# Altium schematic sheet S3_Connectors.SchDoc: Connectors
size Tabloid; DrawnBy: Dhrumil Parikh; SheetNumber: 3; SheetTotal: 6; PageSetup: Record=PageOptions|CenterHorizontal=True|CenterVertical=True|PrintScale=0.62|XCorrection=1.00|YCorrection=1.00|PrintKind=1|BorderSize=5000000|LeftOffset=0|BottomOffset=0|Orientation=2|PaperLength=1000|PaperWidth=1000|Scale=100|PaperSource=7|PrintQuality=600|MediaType=1|DitherType=10|PaperKind=Letter|PrintScaleMode=1; PageSize: T
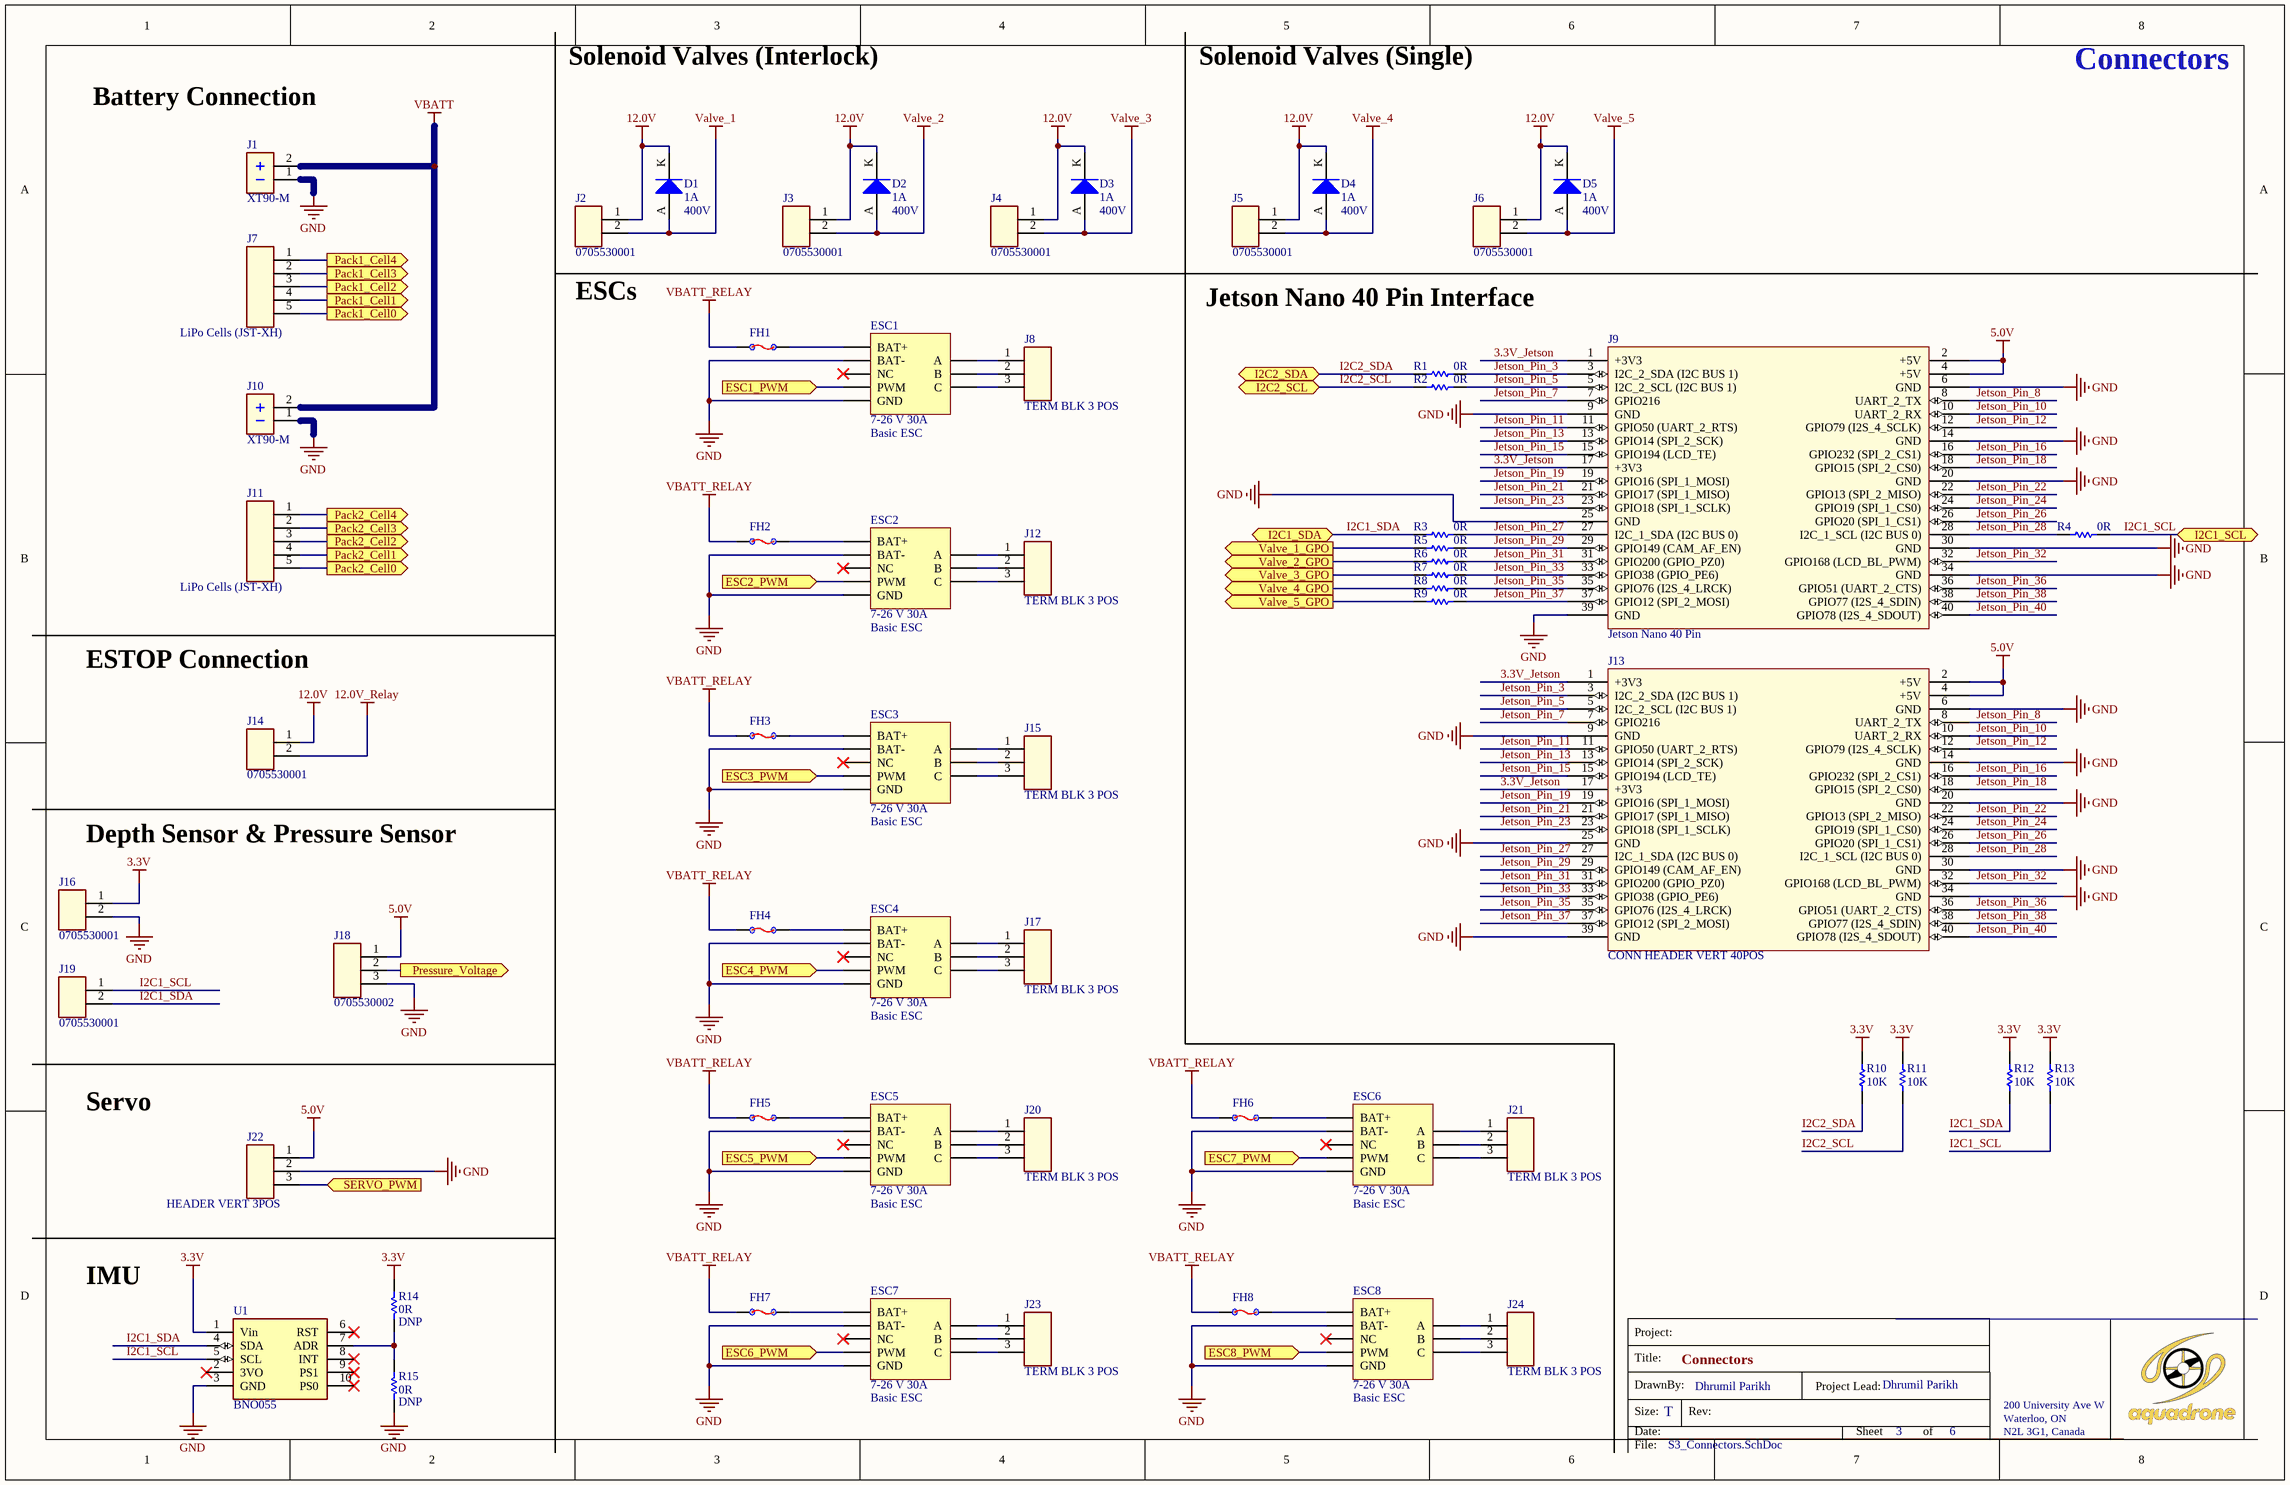
[diagram p0: S3_Connectors.SchDoc]

## Parts
D1  CURRENT: 1A  VR: 400V  [DIOM5226X295N]  (hidden comment: DIODE GEN PURP 400V 1A SMA)
D2  CURRENT: 1A  VR: 400V  [DIOM5226X295N]  (hidden comment: DIODE GEN PURP 400V 1A SMA)
D3  CURRENT: 1A  VR: 400V  [DIOM5226X295N]  (hidden comment: DIODE GEN PURP 400V 1A SMA)
D4  CURRENT: 1A  VR: 400V  [DIOM5226X295N]  (hidden comment: DIODE GEN PURP 400V 1A SMA)
D5  CURRENT: 1A  VR: 400V  [DIOM5226X295N]  (hidden comment: DIODE GEN PURP 400V 1A SMA)
ESC1  VOLTAGE: 7-26 V 30A  [ESC BR]  (hidden comment: Basic ESC)
ESC2  VOLTAGE: 7-26 V 30A  [ESC BR]  (hidden comment: Basic ESC)
ESC3  VOLTAGE: 7-26 V 30A  [ESC BR]  (hidden comment: Basic ESC)
ESC4  VOLTAGE: 7-26 V 30A  [ESC BR]  (hidden comment: Basic ESC)
ESC5  VOLTAGE: 7-26 V 30A  [ESC BR]  (hidden comment: Basic ESC)
ESC6  VOLTAGE: 7-26 V 30A  [ESC BR]  (hidden comment: Basic ESC)
ESC7  VOLTAGE: 7-26 V 30A  [ESC BR]  (hidden comment: Basic ESC)
ESC8  VOLTAGE: 7-26 V 30A  [ESC BR]  (hidden comment: Basic ESC)
FH1  FUSE BLOK CARTRIDGE 600V 16A PCB  [FUSE-HOLDER(5X20)]  (value not drawn)
FH2  FUSE BLOK CARTRIDGE 600V 16A PCB  [FUSE-HOLDER(5X20)]  (value not drawn)
FH3  FUSE BLOK CARTRIDGE 600V 16A PCB  [FUSE-HOLDER(5X20)]  (value not drawn)
FH4  FUSE BLOK CARTRIDGE 600V 16A PCB  [FUSE-HOLDER(5X20)]  (value not drawn)
FH5  FUSE BLOK CARTRIDGE 600V 16A PCB  [FUSE-HOLDER(5X20)]  (value not drawn)
FH6  FUSE BLOK CARTRIDGE 600V 16A PCB  [FUSE-HOLDER(5X20)]  (value not drawn)
FH7  FUSE BLOK CARTRIDGE 600V 16A PCB  [FUSE-HOLDER(5X20)]  (value not drawn)
FH8  FUSE BLOK CARTRIDGE 600V 16A PCB  [FUSE-HOLDER(5X20)]  (value not drawn)
J1  value XT90-M  [XT90]  (hidden comment: CONN XT90 MALE)
J2  value 0705530001  [SHDRRA2W109P0_254_1X2_762X1359X699P]  (hidden comment: CONN HEADER R/A 2POS 2.54MM)
J3  value 0705530001  [SHDRRA2W109P0_254_1X2_762X1359X699P]  (hidden comment: CONN HEADER R/A 2POS 2.54MM)
J4  value 0705530001  [SHDRRA2W109P0_254_1X2_762X1359X699P]  (hidden comment: CONN HEADER R/A 2POS 2.54MM)
J5  value 0705530001  [SHDRRA2W109P0_254_1X2_762X1359X699P]  (hidden comment: CONN HEADER R/A 2POS 2.54MM)
J6  value 0705530001  [SHDRRA2W109P0_254_1X2_762X1359X699P]  (hidden comment: CONN HEADER R/A 2POS 2.54MM)
J7  value LiPo Cells (JST-XH)  [SHDR5W64P0X250_1X5_1490X1150X610P]  (hidden comment: CONN HEADER R/A 5POS 2.5MM)
J8  value TERM BLK 3 POS  [SHDR3W100P0X254_1X3_808X650X1030P]  (hidden comment: TERM BLK 3P SIDE ENT 2.54MM PCB)
J9  value Jetson Nano 40 Pin  [Jetson Nano]  (hidden comment: Jetson Nano 40 Pin Interface)
J10  value XT90-M  [XT90]  (hidden comment: CONN XT90 MALE)
J11  value LiPo Cells (JST-XH)  [SHDR5W64P0X250_1X5_1490X1150X610P]  (hidden comment: CONN HEADER R/A 5POS 2.5MM)
J12  value TERM BLK 3 POS  [SHDR3W100P0X254_1X3_808X650X1030P]  (hidden comment: TERM BLK 3P SIDE ENT 2.54MM PCB)
J13  value CONN HEADER VERT 40POS  [67997-140HLF]  (hidden comment: CONN HEADER VERT 40POS 2.54MM)
J14  value 0705530001  [SHDRRA2W109P0_254_1X2_762X1359X699P]  (hidden comment: CONN HEADER R/A 2POS 2.54MM)
J15  value TERM BLK 3 POS  [SHDR3W100P0X254_1X3_808X650X1030P]  (hidden comment: TERM BLK 3P SIDE ENT 2.54MM PCB)
J16  value 0705530001  [SHDRRA2W109P0_254_1X2_762X1359X699P]  (hidden comment: CONN HEADER R/A 2POS 2.54MM)
J17  value TERM BLK 3 POS  [SHDR3W100P0X254_1X3_808X650X1030P]  (hidden comment: TERM BLK 3P SIDE ENT 2.54MM PCB)
J18  value 0705530002  [SHDR3W89P0X254_1X3_1017X1359X699P]  (hidden comment: CONN HEADER R/A 3POS 2.54MM)
J19  value 0705530001  [SHDRRA2W109P0_254_1X2_762X1359X699P]  (hidden comment: CONN HEADER R/A 2POS 2.54MM)
J20  value TERM BLK 3 POS  [SHDR3W100P0X254_1X3_808X650X1030P]  (hidden comment: TERM BLK 3P SIDE ENT 2.54MM PCB)
J21  value TERM BLK 3 POS  [SHDR3W100P0X254_1X3_808X650X1030P]  (hidden comment: TERM BLK 3P SIDE ENT 2.54MM PCB)
J22  value HEADER VERT 3POS  [61300311121]  (hidden comment: CONN HEADER VERT 3POS 2.54MM)
J23  value TERM BLK 3 POS  [SHDR3W100P0X254_1X3_808X650X1030P]  (hidden comment: TERM BLK 3P SIDE ENT 2.54MM PCB)
J24  value TERM BLK 3 POS  [SHDR3W100P0X254_1X3_808X650X1030P]  (hidden comment: TERM BLK 3P SIDE ENT 2.54MM PCB)
R1  value 0R  [RESC2012X07N]  (hidden comment: RES SMD 0 OHM JUMPER 1/8W 0805)
R2  value 0R  [RESC2012X07N]  (hidden comment: RES SMD 0 OHM JUMPER 1/8W 0805)
R3  value 0R  [RESC2012X07N]  (hidden comment: RES SMD 0 OHM JUMPER 1/8W 0805)
R4  value 0R  [RESC2012X07N]  (hidden comment: RES SMD 0 OHM JUMPER 1/8W 0805)
R5  value 0R  [RESC2012X07N]  (hidden comment: RES SMD 0 OHM JUMPER 1/8W 0805)
R6  value 0R  [RESC2012X07N]  (hidden comment: RES SMD 0 OHM JUMPER 1/8W 0805)
R7  value 0R  [RESC2012X07N]  (hidden comment: RES SMD 0 OHM JUMPER 1/8W 0805)
R8  value 0R  [RESC2012X07N]  (hidden comment: RES SMD 0 OHM JUMPER 1/8W 0805)
R9  value 0R  [RESC2012X07N]  (hidden comment: RES SMD 0 OHM JUMPER 1/8W 0805)
R10  value 10K  [RESC1608X06N]  (hidden comment: RES SMD 10K OHM 1% 1/10W 0603)
R11  value 10K  [RESC1608X06N]  (hidden comment: RES SMD 10K OHM 1% 1/10W 0603)
R12  value 10K  [RESC1608X06N]  (hidden comment: RES SMD 10K OHM 1% 1/10W 0603)
R13  value 10K  [RESC1608X06N]  (hidden comment: RES SMD 10K OHM 1% 1/10W 0603)
R14  value 0R  NOSTUFF: DNP  [RESC2012X07N]  (hidden comment: RES SMD 0 OHM JUMPER 1/8W 0805)
R15  value 0R  NOSTUFF: DNP  [RESC2012X07N]  (hidden comment: RES SMD 0 OHM JUMPER 1/8W 0805)
U1  IC BNO055  [BNO055]  (value not drawn)

## Ports
ESC1_PWM (in), ESC2_PWM (in), ESC3_PWM (in), ESC4_PWM (in), ESC5_PWM (in), ESC6_PWM (in), ESC7_PWM (in), ESC8_PWM (in), I2C1_SCL (bidir), I2C1_SDA (bidir), I2C2_SCL (bidir), I2C2_SDA (bidir), Pack1_Cell0 (out), Pack1_Cell1 (out), Pack1_Cell2 (out), Pack1_Cell3 (out), Pack1_Cell4 (out), Pack2_Cell0 (out), Pack2_Cell1 (out), Pack2_Cell2 (out), Pack2_Cell3 (out), Pack2_Cell4 (out), Pressure_Voltage (out), SERVO_PWM (in), Valve_1_GPO (out), Valve_2_GPO (out), Valve_3_GPO (out), Valve_4_GPO (out), Valve_5_GPO (out)

## Nets
3.3V: J16.1 R10.2 R11.2 R12.2 R13.2 R14.1 U1.1(Vin)
5.0V: J9.2(+5V) J9.4(+5V) J13.2(+5V) J13.4(+5V) J18.1 J22.1
12.0V: D1.K D2.K D3.K D4.K D5.K J2.1 J3.1 J4.1 J5.1 J6.1 J14.1
12.0V_Relay: J14.2
GND: ESC1.BAT- ESC1.GND ESC2.BAT- ESC2.GND ESC3.BAT- ESC3.GND ESC4.BAT- ESC4.GND ESC5.BAT- ESC5.GND ESC6.BAT- ESC6.GND ESC7.BAT- ESC7.GND ESC8.BAT- ESC8.GND J1.1 J9.6(GND) J9.9(GND) J9.14(GND) J9.20(GND) J9.25(GND) J9.30(GND) J9.34(GND) J9.39(GND) J10.1 J13.6(GND) J13.9(GND) J13.14(GND) J13.20(GND) J13.25(GND) J13.30(GND) J13.34(GND) J13.39(GND) J16.2 J18.3 J22.2 R15.2 U1.3(GND)
Valve_1: D1.A J2.2
Valve_2: D2.A J3.2
Valve_3: D3.A J4.2
Valve_4: D4.A J5.2
Valve_5: D5.A J6.2
VBATT: J1.2 J10.2
VBATT_RELAY: FH1.1 FH2.1 FH3.1 FH4.1 FH5.1 FH6.1 FH7.1 FH8.1
3.3V_Jetson: J9.1(+3V3) J9.17(+3V3) J13.1(+3V3) J13.17(+3V3)
ESC1_PWM: ESC1.PWM ; port ESC1_PWM
ESC2_PWM: ESC2.PWM ; port ESC2_PWM
ESC3_PWM: ESC3.PWM ; port ESC3_PWM
ESC4_PWM: ESC4.PWM ; port ESC4_PWM
ESC5_PWM: ESC5.PWM ; port ESC5_PWM
ESC6_PWM: ESC7.PWM ; port ESC6_PWM
ESC7_PWM: ESC6.PWM ; port ESC7_PWM
ESC8_PWM: ESC8.PWM ; port ESC8_PWM
I2C1_SCL: J19.1 R4.2 R13.1 U1.5(SCL) ; port I2C1_SCL
I2C1_SDA: J19.2 R3.1 R12.1 U1.4(SDA) ; port I2C1_SDA
I2C2_SCL: R2.1 R11.1 ; port I2C2_SCL
I2C2_SDA: R1.1 R10.1 ; port I2C2_SDA
Jetson_Pin_3: J9.3(I2C_2_SDA_(I2C_BUS_1)) J13.3(I2C_2_SDA_(I2C_BUS_1)) R1.2
Jetson_Pin_5: J9.5(I2C_2_SCL_(I2C_BUS_1)) J13.5(I2C_2_SCL_(I2C_BUS_1)) R2.2
Jetson_Pin_7: J9.7(GPIO216) J13.7(GPIO216)
Jetson_Pin_8: J9.8(UART_2_TX) J13.8(UART_2_TX)
Jetson_Pin_10: J9.10(UART_2_RX) J13.10(UART_2_RX)
Jetson_Pin_11: J9.11(GPIO50_(UART_2_RTS)) J13.11(GPIO50_(UART_2_RTS))
Jetson_Pin_12: J9.12(GPIO79_(I2S_4_SCLK)) J13.12(GPIO79_(I2S_4_SCLK))
Jetson_Pin_13: J9.13(GPIO14_(SPI_2_SCK)) J13.13(GPIO14_(SPI_2_SCK))
Jetson_Pin_15: J9.15(GPIO194_(LCD_TE)) J13.15(GPIO194_(LCD_TE))
Jetson_Pin_16: J9.16(GPIO232_(SPI_2_CS1)) J13.16(GPIO232_(SPI_2_CS1))
Jetson_Pin_18: J9.18(GPIO15_(SPI_2_CS0)) J13.18(GPIO15_(SPI_2_CS0))
Jetson_Pin_19: J9.19(GPIO16_(SPI_1_MOSI)) J13.19(GPIO16_(SPI_1_MOSI))
Jetson_Pin_21: J9.21(GPIO17_(SPI_1_MISO)) J13.21(GPIO17_(SPI_1_MISO))
Jetson_Pin_22: J9.22(GPIO13_(SPI_2_MISO)) J13.22(GPIO13_(SPI_2_MISO))
Jetson_Pin_23: J9.23(GPIO18_(SPI_1_SCLK)) J13.23(GPIO18_(SPI_1_SCLK))
Jetson_Pin_24: J9.24(GPIO19_(SPI_1_CS0)) J13.24(GPIO19_(SPI_1_CS0))
Jetson_Pin_26: J9.26(GPIO20_(SPI_1_CS1)) J13.26(GPIO20_(SPI_1_CS1))
Jetson_Pin_27: J9.27(I2C_1_SDA_(I2C_BUS_0)) J13.27(I2C_1_SDA_(I2C_BUS_0)) R3.2
Jetson_Pin_28: J9.28(I2C_1_SCL_(I2C_BUS_0)) J13.28(I2C_1_SCL_(I2C_BUS_0)) R4.1
Jetson_Pin_29: J9.29(GPIO149_(CAM_AF_EN)) J13.29(GPIO149_(CAM_AF_EN)) R5.2
Jetson_Pin_31: J9.31(GPIO200_(GPIO_PZ0)) J13.31(GPIO200_(GPIO_PZ0)) R6.2
Jetson_Pin_32: J9.32(GPIO168_(LCD_BL_PWM)) J13.32(GPIO168_(LCD_BL_PWM))
Jetson_Pin_33: J9.33(GPIO38_(GPIO_PE6)) J13.33(GPIO38_(GPIO_PE6)) R7.2
Jetson_Pin_35: J9.35(GPIO76_(I2S_4_LRCK)) J13.35(GPIO76_(I2S_4_LRCK)) R8.2
Jetson_Pin_36: J9.36(GPIO51_(UART_2_CTS)) J13.36(GPIO51_(UART_2_CTS))
Jetson_Pin_37: J9.37(GPIO12_(SPI_2_MOSI)) J13.37(GPIO12_(SPI_2_MOSI)) R9.2
Jetson_Pin_38: J9.38(GPIO77_(I2S_4_SDIN)) J13.38(GPIO77_(I2S_4_SDIN))
Jetson_Pin_40: J9.40(GPIO78_(I2S_4_SDOUT)) J13.40(GPIO78_(I2S_4_SDOUT))
Pack1_Cell0: J7.5 ; port Pack1_Cell0
Pack1_Cell1: J7.4 ; port Pack1_Cell1
Pack1_Cell2: J7.3 ; port Pack1_Cell2
Pack1_Cell3: J7.2 ; port Pack1_Cell3
Pack1_Cell4: J7.1 ; port Pack1_Cell4
Pack2_Cell0: J11.5 ; port Pack2_Cell0
Pack2_Cell1: J11.4 ; port Pack2_Cell1
Pack2_Cell2: J11.3 ; port Pack2_Cell2
Pack2_Cell3: J11.2 ; port Pack2_Cell3
Pack2_Cell4: J11.1 ; port Pack2_Cell4
Pressure_Voltage: J18.2 ; port Pressure_Voltage
SERVO_PWM: J22.3 ; port SERVO_PWM
Valve_1_GPO: R5.1 ; port Valve_1_GPO
Valve_2_GPO: R6.1 ; port Valve_2_GPO
Valve_3_GPO: R7.1 ; port Valve_3_GPO
Valve_4_GPO: R8.1 ; port Valve_4_GPO
Valve_5_GPO: R9.1 ; port Valve_5_GPO
NetESC1_A: ESC1.A J8.1
NetESC1_B: ESC1.B J8.2
NetESC1_BAT+: ESC1.BAT+ FH1.2
NetESC1_C: ESC1.C J8.3
NetESC2_A: ESC2.A J12.1
NetESC2_B: ESC2.B J12.2
NetESC2_BAT+: ESC2.BAT+ FH2.2
NetESC2_C: ESC2.C J12.3
NetESC3_A: ESC3.A J15.1
NetESC3_B: ESC3.B J15.2
NetESC3_BAT+: ESC3.BAT+ FH3.2
NetESC3_C: ESC3.C J15.3
NetESC4_A: ESC4.A J17.1
NetESC4_B: ESC4.B J17.2
NetESC4_BAT+: ESC4.BAT+ FH4.2
NetESC4_C: ESC4.C J17.3
NetESC5_A: ESC5.A J20.1
NetESC5_B: ESC5.B J20.2
NetESC5_BAT+: ESC5.BAT+ FH5.2
NetESC5_C: ESC5.C J20.3
NetESC6_A: ESC6.A J21.1
NetESC6_B: ESC6.B J21.2
NetESC6_BAT+: ESC6.BAT+ FH6.2
NetESC6_C: ESC6.C J21.3
NetESC7_A: ESC7.A J23.1
NetESC7_B: ESC7.B J23.2
NetESC7_BAT+: ESC7.BAT+ FH7.2
NetESC7_C: ESC7.C J23.3
NetESC8_A: ESC8.A J24.1
NetESC8_B: ESC8.B J24.2
NetESC8_BAT+: ESC8.BAT+ FH8.2
NetESC8_C: ESC8.C J24.3
NetR14_2: R14.2 R15.1 U1.7(ADR)

Not connected (* = marked no-connect by the designer): ESC1 NC*; ESC2 NC*; ESC3 NC*; ESC4 NC*; ESC5 NC*; ESC6 NC*; ESC7 NC*; ESC8 NC*; U1 2(3VO)* 6(RST)* 8(INT)* 9(PS1)* 10(PS0)*

## Notes on the sheet
- Solenoid Valves (Interlock)
- Solenoid Valves (Single)
- Battery Connection
- (near J2) ESCs
- Jetson Nano 40 Pin Interface
- ESTOP Connection
- Depth Sensor & Pressure Sensor
- Servo
- IMU
- Title:
- Project:
- Size:
- Date:
- DrawnBy:
- Rev:
- Project Lead:
- Sheet
- Dhrumil Parikh
- of
- 200 University Ave W
- Waterloo, ON
- N2L 3G1, Canada
- File:

## Library data of the parts
D1-D5 = DIODE GEN PURP 400V 1A SMA: MFG_PART_NO: S1GTR; MFG: SMC Diode Solutions; VALUE: S1GTR; COST: 0.17
ESC1-ESC8 = Basic ESC: MFG_PART_NO: BESC30-R3; COST1K: 25; MFG: Blue Robotics; ROHS: Y; VALUE: Basic ESC
FH1-FH8 = FUSE BLOK CARTRIDGE 600V 16A PCB: MFG_PART_NO: 0031.8231; MFG: Schurter Inc.; HOLD: 14A; VALUE: Fuse Holder; TRIP: 15A; COST: 2.89; VOLTAGE: 600V
J1 J10 = CONN XT90 MALE: MFG_PART_NO: FIT0588; MFG: DFRobot; COST: 5.66000
J2-J6 J14 J16 J19 = CONN HEADER R/A 2POS 2.54MM: MFG: Molex; COST: 1.12; MFG_PART_NO: 0705530001
J7 J11 = CONN HEADER R/A 5POS 2.5MM: MFG_PART_NO: S5B-XH-A(LF)(SN); MFG: JST Sales America Inc.; COST: 0.43
J8 J12 J15 J17 J20 J21 J23 J24 = TERM BLK 3P SIDE ENT 2.54MM PCB: MFG_PART_NO: 282834-3; MFG: TE Connectivity; COST: 2.9
J13 = CONN HEADER VERT 40POS 2.54MM: MFG: Amphenol; COST: 4.1; MFG_PART_NO: 67997-140HLF
J18 = CONN HEADER R/A 3POS 2.54MM: MFG: Molex; COST: 1.47; MFG_PART_NO: 0705530002
J22 = CONN HEADER VERT 3POS 2.54MM: MFG: Wurth Electronics Inc.; COST: 0.18; MFG_PART_NO: 61300311121
R1-R9 R14 R15 = RES SMD 0 OHM JUMPER 1/8W 0805: MFG_PART_NO: ERJ-6GEY0R00V; MFG: Panasonic; COST: 0.15
R10-R13 = RES SMD 10K OHM 1% 1/10W 0603: MFG_PART_NO: CRCW060310K0FKEA; MFG: Vishay Dale; COST: 0.15; TOLERANCE: 1%
U1 = IC BNO055: MFG: Adafruit Industries LLC; COST: 50; VALUE: BNO055; MFG_PART_NO: BNO055
J9 = Jetson Nano 40 Pin Interface: COST: 60; MFG: Jetson; MFG_PART_NO: Nano